# Altium schematic sheet block_diagram.SchDoc
size A4
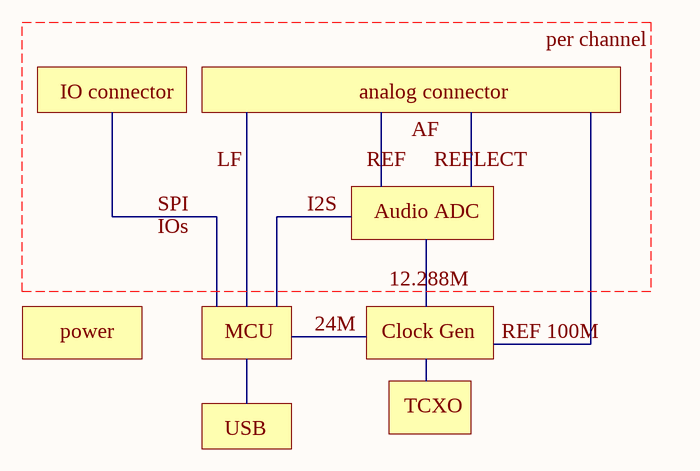
[diagram p0: block_diagram.SchDoc]

## Notes on the sheet
- per channel
- IO connector
- LF
- analog connector
- REF
- AF
- REFLECT
- SPI
- IOs
- I2S
- Audio ADC
- 12.288M
- power
- MCU
- 24M
- Clock Gen
- REF 100M
- USB
- TCXO